# EAGLE design ap_eap_pcb (EAGLE 9.6.2)
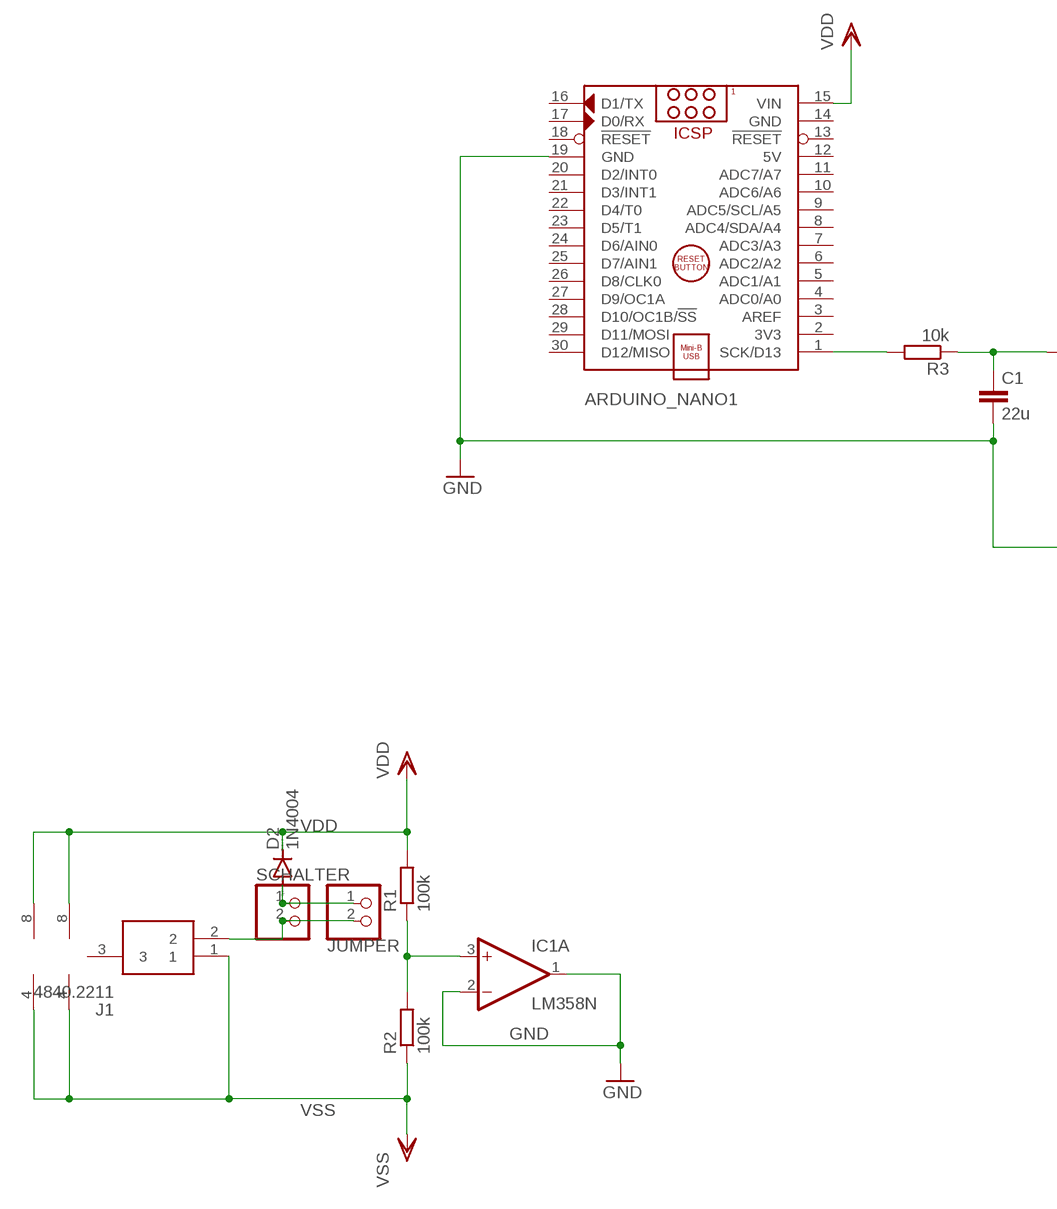
[diagram p0: schematic, sheet 1, part 1 of 2]
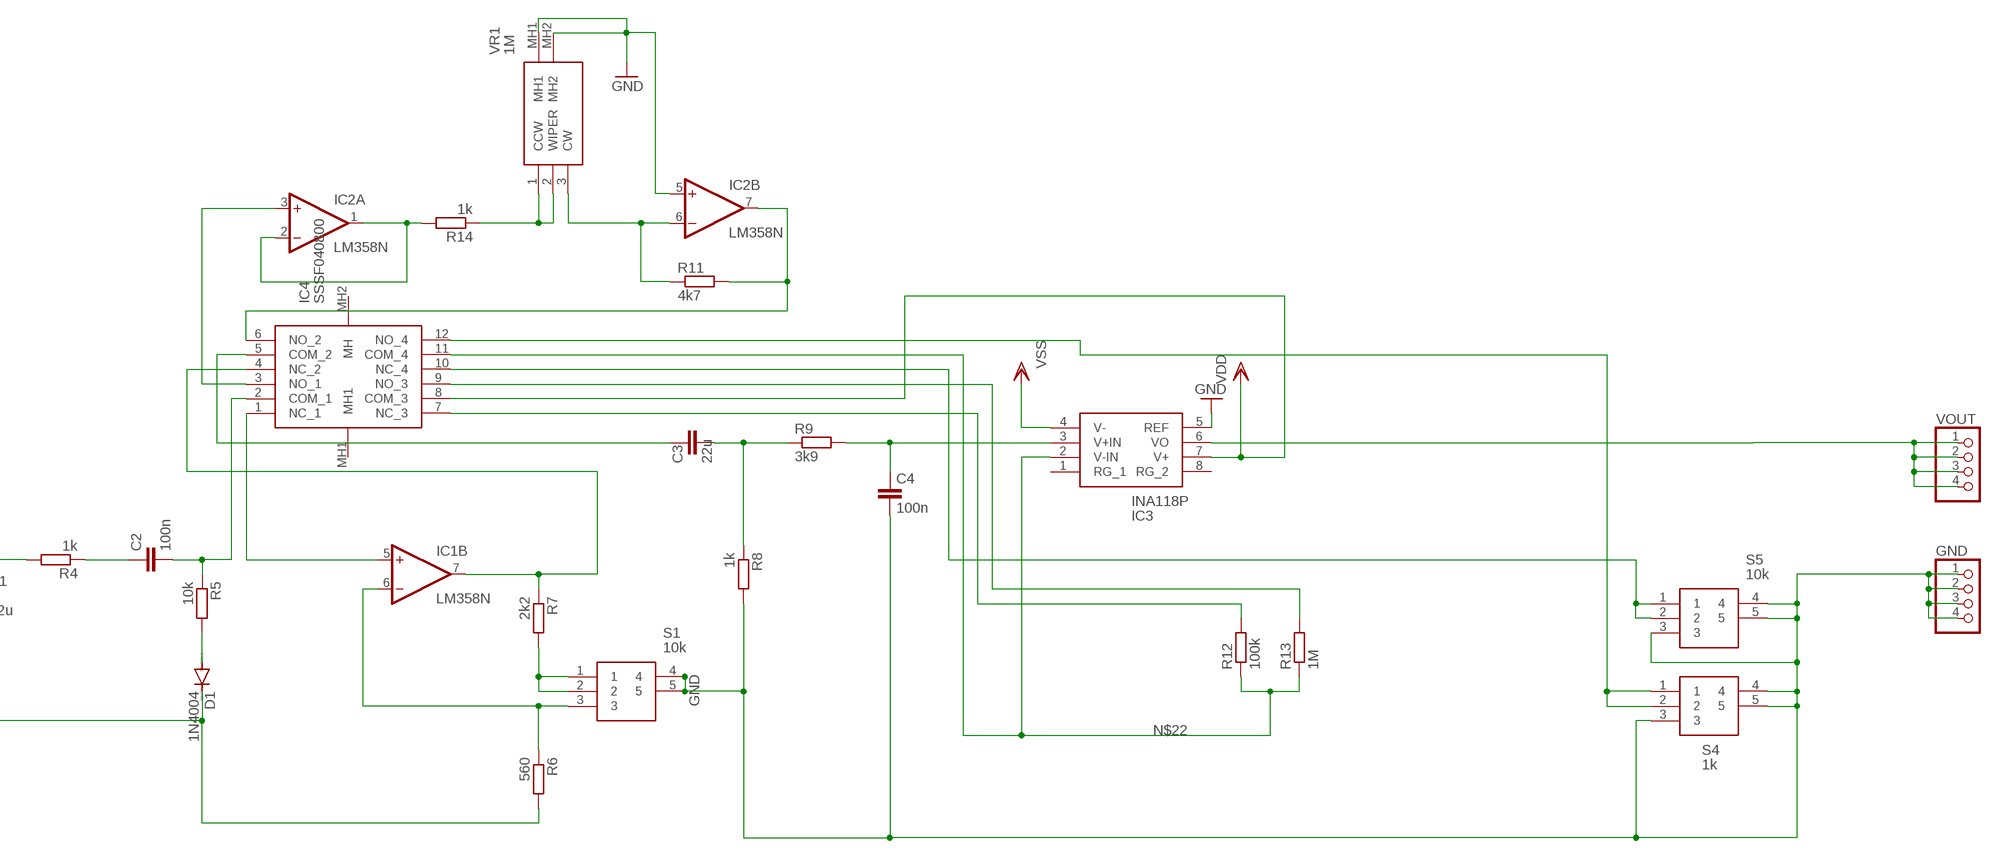
[diagram p1: schematic, sheet 1, part 2 of 2]

## Parts
ARDUINO_NANO1  ARDUINO_NANO  [ARDUINO_NANO]
C1  22u  C-EU025-024X044  [C025-024X044]
C2  100n  C-EU050-024X044  [C050-024X044]
C3  22u  C-EU025-050X050  [C025-050X050]
C4  100n  C-EU025-024X044  [C025-024X044]
D1  1N4004  [DO41-10]
D2  1N4004  [DO41-10]
GND  PINHD-1X4  [1X04]
IC1  LM358N  [DIL08]
IC2  LM358N  [DIL08]
IC3  INA118P  [DIP794W53P254L959H508Q8N]
IC4  SSSF040800  [SSSF040800]
J1  4840.2211  [48402211]
JUMPER  PINHD-1X2  [1X02]
R1  100k  R-EU_0309/12  [0309/12]
R2  100k  R-EU_0309/12  [0309/12]
R3  10k  R-EU_0309/12  [0309/12]
R4  1k  R-EU_0309/12  [0309/12]
R5  10k  R-EU_0309/12  [0309/12]
R6  560  R-EU_0309/12  [0309/12]
R7  2k2  R-EU_0309/12  [0309/12]
R8  1k  R-EU_0309/12  [0309/12]
R9  3k9  R-EU_0309/12  [0309/12]
R11  4k7  R-EU_0309/12  [0309/12]
R12  100k  R-EU_0309/12  [0309/12]
R13  1M  R-EU_0309/12  [0309/12]
R14  1k  R-EU_0309/12  [0309/12]
S1  10k  PTV09A-4225F-B102  [PTV09A4020FB103]
S4  1k  PTV09A-4225F-B102  [PTV09A4020FB103]
S5  10k  PTV09A-4225F-B102  [PTV09A4020FB103]
SCHALTER  PINHD-1X2  [1X02]
VOUT  PINHD-1X4  [1X04]
VR1  1M  RV09AF-40-20K-A1M  [RV09AF4020KA1M]

## Nets
GND: ARDUINO_NANO1.19(GND) C1.2 C4.2 D1.C GND.1 GND.2 GND.3 GND.4 IC1.1(A:OUT) IC1.2(A:-IN) IC2.5(B:+IN) IC3.5(REF) R6.2 R8.2 S1.4 S1.5 S4.3 S4.4 S4.5 S5.3 S5.4 S5.5 VR1.MH1 VR1.MH2
N$1: C1.1 R3.1 R4.2
N$2: IC1.3(A:+IN) R1.1 R2.2
N$3: ARDUINO_NANO1.1(SCK/D13) R3.2
N$4: C2.1 R4.1
N$5: C2.2 IC4.2(COM_1) R5.1
N$6: D1.A R5.2
N$7: C3.2 R8.1 R9.1
N$8: IC1.7(B:OUT) IC4.4(NC_2) R7.1
N$9: R7.2 S1.1 S1.2
N$10: IC1.6(B:-IN) R6.1 S1.3
N$11: IC1.5(B:+IN) IC4.1(NC_1)
N$12: C3.1 IC4.5(COM_2)
N$13: IC3.6(VO)
N$14: C4.1 IC3.3(V+IN) R9.2
N$15: VOUT.1 VOUT.2 VOUT.3 VOUT.4
N$16: IC2.3(A:+IN) IC4.3(NO_1)
N$17: IC2.1(A:OUT) IC2.2(A:-IN) R14.2
N$18: IC4.7(NC_3) R12.2
N$19: IC2.7(B:OUT) IC4.6(NO_2) R11.2
N$20: IC2.6(B:-IN) R11.1 VR1.3(CW)
N$21: IC4.9(NO_3) R13.2
N$22: IC3.2(V-IN) IC4.11(COM_4) R12.1 R13.1
N$23: IC4.12(NO_4) S4.1 S4.2
N$24: IC4.10(NC_4) S5.1 S5.2
N$25: J1.2 JUMPER.2 SCHALTER.2
N$26: D2.A JUMPER.1 SCHALTER.1
N$27: R14.1 VR1.1(CCW) VR1.2(WIPER)
VDD: ARDUINO_NANO1.15(VIN) D2.C IC1.8(P:V+) IC2.8(P:V+) IC3.7(V+) IC4.8(COM_3) R1.2
VSS: IC1.4(P:V-) IC2.4(P:V-) IC3.4(V-) J1.1 R2.1
Unconnected: ARDUINO_NANO1.2(3V3) ARDUINO_NANO1.3(AREF) ARDUINO_NANO1.4(ADC0/A0) ARDUINO_NANO1.5(ADC1/A1) ARDUINO_NANO1.6(ADC2/A2) ARDUINO_NANO1.7(ADC3/A3) ARDUINO_NANO1.8(ADC4/SDA/A4) ARDUINO_NANO1.9(ADC5/SCL/A5) ARDUINO_NANO1.10(ADC6/A6) ARDUINO_NANO1.11(ADC7/A7) ARDUINO_NANO1.13(!RESET) ARDUINO_NANO1.16(D1/TX) ARDUINO_NANO1.17(D0/RX) ARDUINO_NANO1.18(!RESET) ARDUINO_NANO1.20(D2/INT0) ARDUINO_NANO1.21(D3/INT1) ARDUINO_NANO1.22(D4/T0) ARDUINO_NANO1.23(D5/T1) ARDUINO_NANO1.24(D6/AIN0) ARDUINO_NANO1.25(D7/AIN1) ARDUINO_NANO1.26(D8/CLK0) ARDUINO_NANO1.27(D9/OC1A) ARDUINO_NANO1.28(D10/OC1B/!SS) ARDUINO_NANO1.29(D11/MOSI) ARDUINO_NANO1.30(D12/MISO) IC3.1(RG_1) IC3.8(RG_2) IC4.MH1 IC4.MH2(MH) J1.3

## Power pins joined to a net without a drawn wire
5V: ARDUINO_NANO1.12(5V)
GND: ARDUINO_NANO1.14(GND)

## Library data of the parts
ARDUINO_NANO1 = ArduinoNanoV30:ARDUINO_NANO: Arduino Nano V3.0 Module Overview: The Arduino Nano is a small, complete, and breadboard-friendly board based on the ATmega328 (Arduino Nano 3.x) or ATmega168 (Arduino Nano 2.x). It has more or less the same functionality of the Arduino Duemilanove, but in a different package. It lacks only a DC power jack, and works with a Mini-B USB cable instead of a standard one. The Nano was designed and is being produced by Gravitech <http://www.gravitech.us/arna30wiatp.html>. General specifications: Item Value Microcontroller Atmel ATmega168 or ATmega328 Operating Voltage (logic level) 5 V Input Voltage (recommended) 7-12 V Input Voltage (limits) 6-20 V Digital I/O Pins 14 (of which 6 provide PWM output) Analog Input Pins 8 DC Current per I/O Pin 40 mA Flash Memory 16 KB (ATmega168) or 32 KB (ATmega328) of which 2 KB used by bootloader SRAM 1 KB (ATmega168) or 2 KB (ATmega328) EEPROM 512 bytes (ATmega168) or 1 KB (ATmega328) Clock Speed 16 MHz Dimensions (Inches) 0.73" x 1.70" Dimensions (mm) 18mm x 45mm Overall height About 9 mm (not including pins) Weigth 5 g Power: The Arduino Nano can be powered via the Mini-B USB connection, 6-20V unregulated external power supply (pin 30), or 5V regulated external power supply (pin 27). The power source is automatically selected to the highest voltage source. Memory: The ATmega168 has 16 KB of flash memory for storing code (of which 2 KB is used for the bootloader); the ATmega328 has 32 KB, (also with 2 KB used for the bootloader). The ATmega168 has 1 KB of SRAM and 512 bytes of EEPROM (which can be read and written with the EEPROM library); the ATmega328 has 2 KB of SRAM and 1 KB of EEPROM. Input and Output: Each of the 14 digital pins on the Nano can be used as an input or output, using pinMode(), digitalWrite(), and digitalRead() functions. They operate at 5 volts. Each pin can provide or receive a maximum of 40 mA and has an internal pull-up resistor (disconnected by default) of 20-50 kOhms. In addition, some pins have specialized functions. Visit Arduino - ArduinoBoardNano <https://www.arduino.cc/en/Main/ArduinoBoardNano>
C1-C4 = rcl:C-EU: CAPACITOR, European symbol; SPICEPREFIX: C
D1 D2 = diode:1N4004: DIODE general purpose rectifier, 1 A
GND VOUT = pinhead:PINHD-1X4: PIN HEADER
IC1 IC2 = linear:LM358: OP AMP also LM158; LM258; LM2904 Source: http://cache.national.com/ds/LM/LM158.pdf
IC3 = INA118P:INA118P: INA118P, Instrumentation Amplifier, 73dB CMRR, 8-Pin PDIP Source: Datasheet <http://www.ti.com/lit/ds/symlink/ina118.pdf>; DESCRIPTION: INA118P, Instrumentation Amplifier, 73dB CMRR, 8-Pin PDIP; HEIGHT: 5.08mm; MANUFACTURER_NAME: Texas Instruments; MANUFACTURER_PART_NUMBER: INA118P; MOUSER_PART_NUMBER: 595-INA118P; MOUSER_PRICE-STOCK: https://www.mouser.co.uk/ProductDetail/Texas-Instruments/INA118P/?qs=VBduBm9rCJTJMgcSbr%252BM%252BQ%3D%3D
IC4 = SSSF040800:SSSF040800: Through Hole Slide Switch 4PDT Maintained 100 mA Slide Source: Datasheet <http://uk.rs-online.com/web/p/products/1238902>; DESCRIPTION: Through Hole Slide Switch 4PDT Maintained 100 mA Slide; HEIGHT: 14.5mm; MANUFACTURER_NAME: ALPS; MANUFACTURER_PART_NUMBER: SSSF040800; RS_PART_NUMBER: 1238902; RS_PRICE-STOCK: http://uk.rs-online.com/web/p/products/1238902
J1 = 4840.2211:4840.2211: DC Power Connectors DC SOCKET 2.35MM PCB MOUNT Source: Datasheet <http://www.schurterinc.com/bundles/snceschurter/epim/_ProdPool_/newDS/en/typ_4840.2211.pdf>; DESCRIPTION: DC Power Connectors DC SOCKET 2.35MM PCB MOUNT; HEIGHT: 11mm; MANUFACTURER_NAME: SCHURTER; MANUFACTURER_PART_NUMBER: 4840.2211; MOUSER_PART_NUMBER: 693-4840.2211; MOUSER_PRICE-STOCK: https://www.mouser.co.uk/ProductDetail/Schurter/48402211?qs=wwP%252BWDYHj0YnjLRL9j928g%3D%3D
JUMPER SCHALTER = pinhead:PINHD-1X2: PIN HEADER
R1-R9 R11-R14 = rcl:R-EU_: RESISTOR, European symbol; SPICEPREFIX: R
S1 S4 S5 = PTV09A-4225F-B102:PTV09A-4225F-B102: 9mm carbon potentiometer linear 1K 20% Source: Datasheet <https://www.bourns.com/pdfs/PTV09.pdf>; DESCRIPTION: 9mm carbon potentiometer linear 1K 20%; HEIGHT: 20mm; MANUFACTURER_NAME: Bourns; MANUFACTURER_PART_NUMBER: PTV09A-4225F-B102; MOUSER_PART_NUMBER: 652-PTV09A-4225FB102; MOUSER_PRICE-STOCK: https://www.mouser.co.uk/ProductDetail/Bourns/PTV09A-4225F-B102?qs=Qzws7J6gxqyeFhc0kO3Q7A%3D%3D
VR1 = RV09AF-40-20K-A1M:RV09AF-40-20K-A1M: Potentiometers Audio 9mm 1M Source: Datasheet <https://www.mouser.co.uk/datasheet/2/13/V09AF-1522357.pdf>; DESCRIPTION: Potentiometers Audio 9mm 1M; HEIGHT: 20.5mm; MANUFACTURER_NAME: Alpha (Taiwan); MANUFACTURER_PART_NUMBER: RV09AF-40-20K-A1M; MOUSER_PART_NUMBER: 317-2080F-1M; MOUSER_PRICE-STOCK: https://www.mouser.co.uk/ProductDetail/Alpha-Taiwan/RV09AF-40-20K-A1M?qs=j%252B1pi9TdxUYsYyUO2HEVPg%3D%3D

## Board
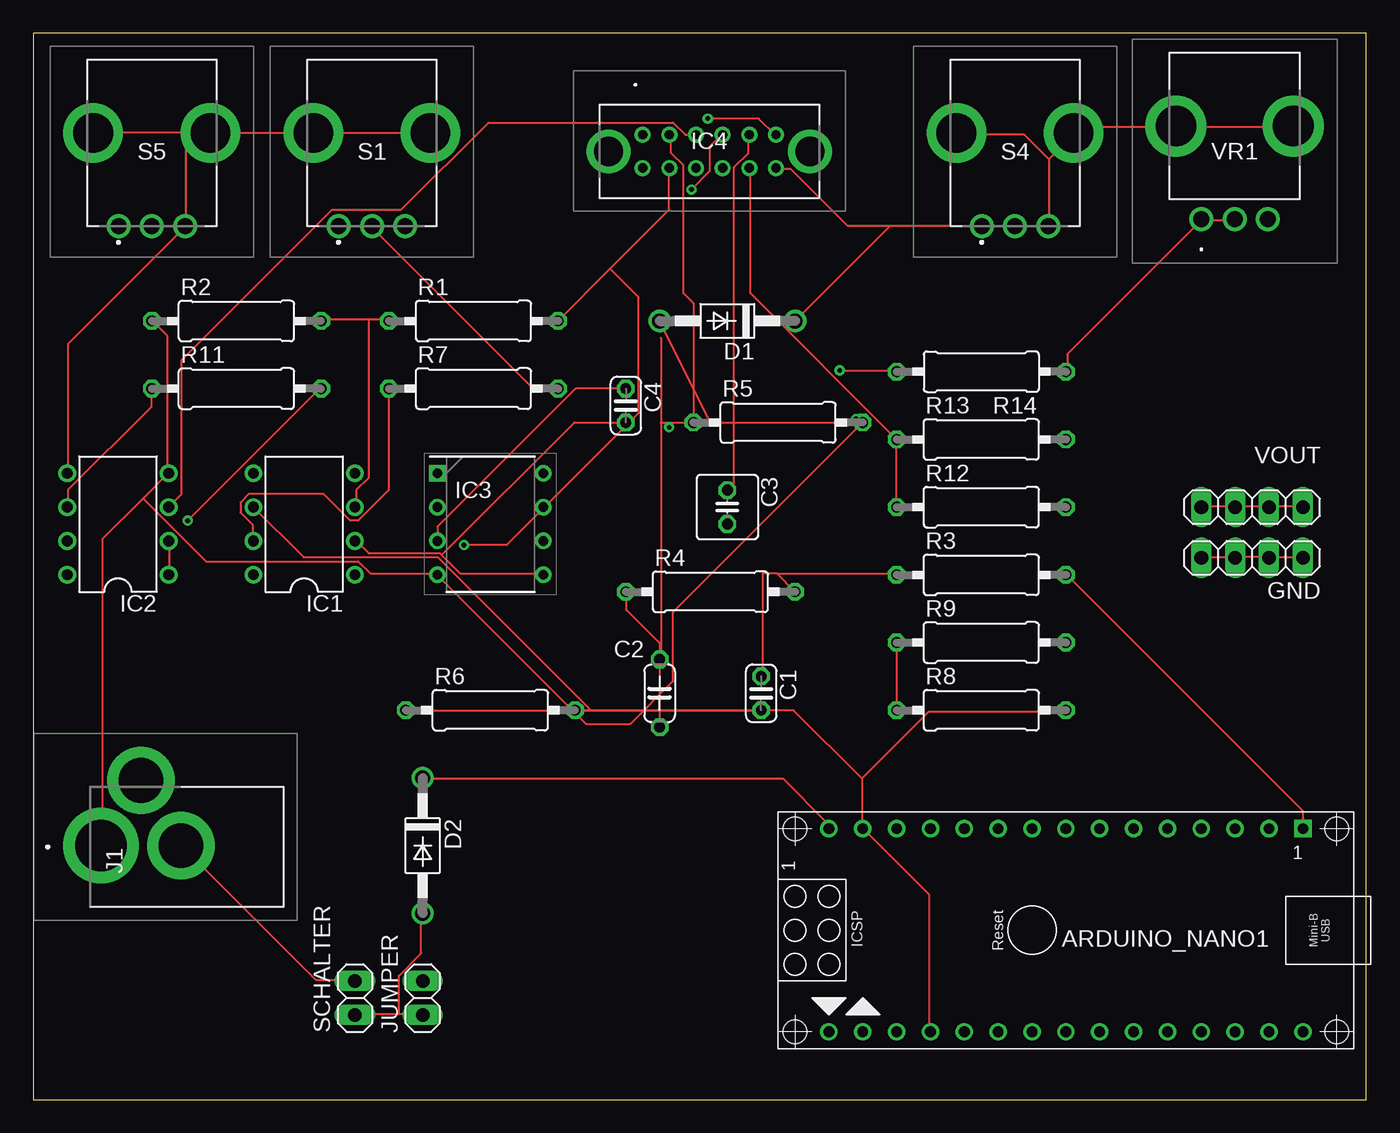
[diagram p2: board, top side]
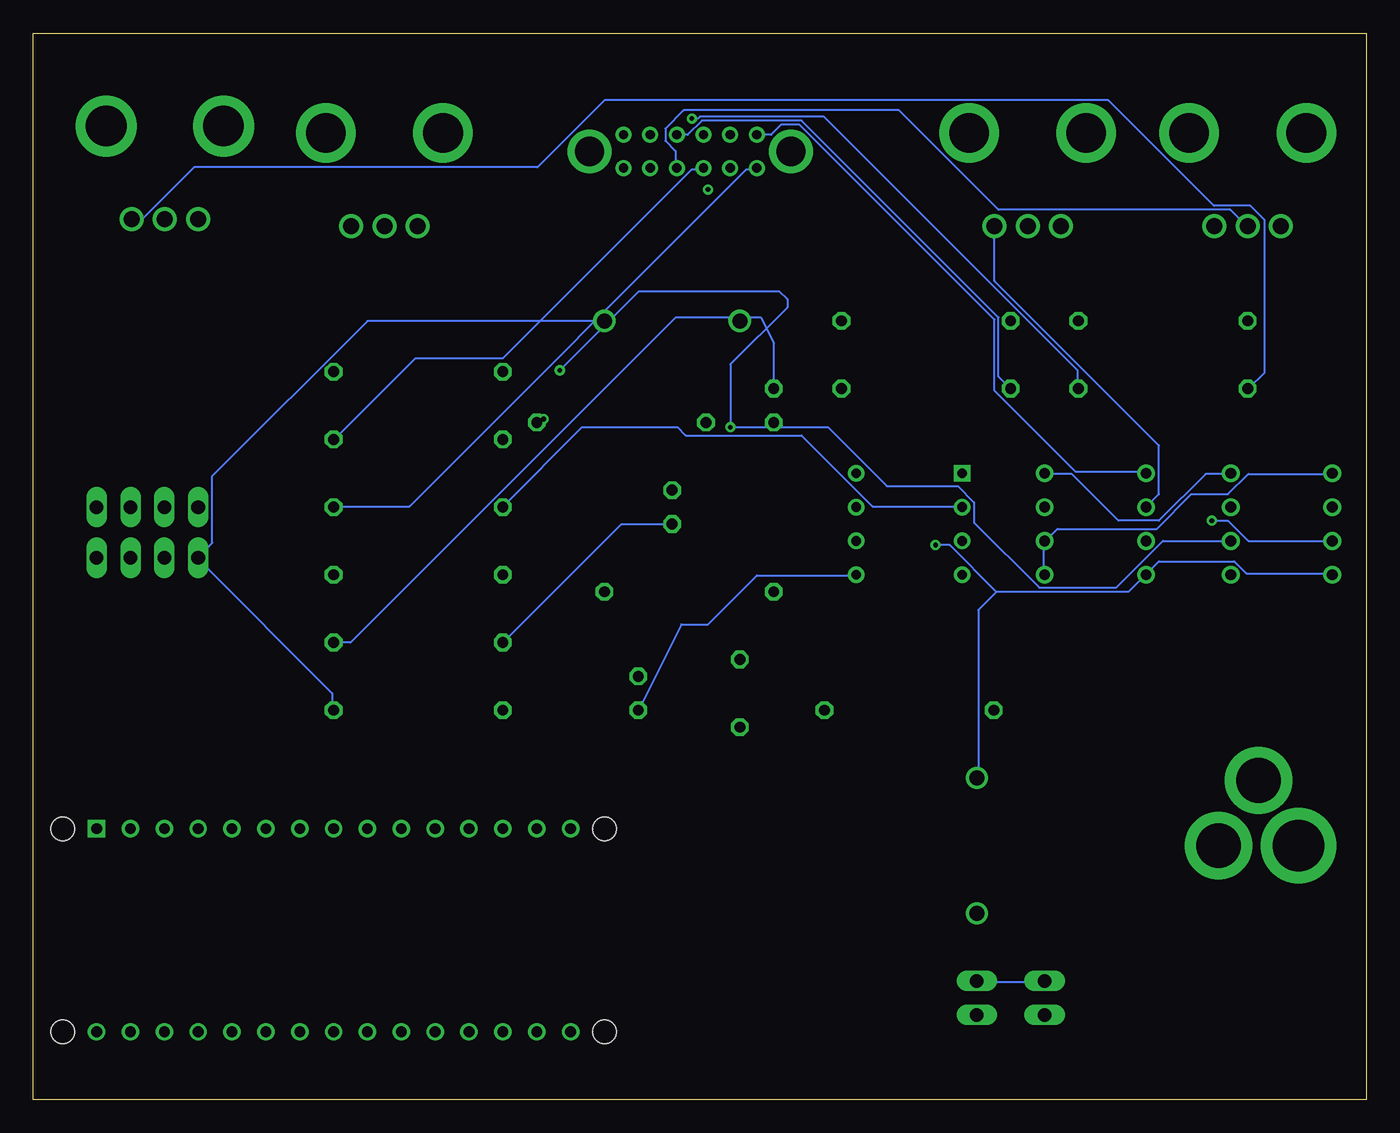
[diagram p3: board, bottom side, seen from below]

Size 100 x 80 mm. Coordinates in mm from the lower left corner, seen from the top.
Outline: 0,0 100,0 100,80 0,80 0,0
Copper layers (1*16): Top 0.035mm / dielectric 1.5mm / Bottom 0.035mm
Design rules "default": minimum track width 6mil, minimum drill 0.35mm, track to track 6mil, track to pad 6mil, pad to pad 6mil, via to via 6mil, smd to smd 6mil, copper to edge 40mil, drill to drill 6mil, minimum pad ring 10mil, minimum via ring 8mil, stop-mask expansion 4mil, vias tented up to drill 0mil, thermal gap 10mil

### Footprints (pad centres in the part's own frame; a part is rotated, then mirrored left to right if it is on the bottom)
ARDUINO_NANO = drill 0.8 square: 1 -20.32,-7.62 | drill 0.8: 2 -17.78,-7.62; 3 -15.24,-7.62; 4 -12.7,-7.62; 5 -10.16,-7.62; 6 -7.62,-7.62; 7 -5.08,-7.62; 8 -2.54,-7.62; 9 0,-7.62; 10 2.54,-7.62; 11 5.08,-7.62; 12 7.62,-7.62; 13 10.16,-7.62; 14 12.7,-7.62; 15 15.24,-7.62; 16 15.24,7.62; 17 12.7,7.62; 18 10.16,7.62; 19 7.62,7.62; 20 5.08,7.62; 21 2.54,7.62; 22 0,7.62; 23 -2.54,7.62; 24 -5.08,7.62; 25 -7.62,7.62; 26 -10.16,7.62; 27 -12.7,7.62; 28 -15.24,7.62; 29 -17.78,7.62; 30 -20.32,7.62 | hole 1.778: -22.86,-7.62; -22.86,7.62; 17.78,7.62; 17.78,-7.62
C025-024X044 = drill 0.813 octagon: 1 -1.27,0; 2 1.27,0
C050-024X044 = drill 0.813 octagon: 1 -2.54,0; 2 2.54,0
C025-050X050 = drill 0.813 octagon: 1 -1.27,0; 2 1.27,0
DO41-10 = drill 1.118: A 5.08,0; C -5.08,0
1X04 = drill 1.016 long: 1 -3.81,0; 2 -1.27,0; 3 1.27,0; 4 3.81,0
DIL08 = drill 0.813 pad 1.27: 1 -3.81,-3.81; 2 -1.27,-3.81; 3 1.27,-3.81; 4 3.81,-3.81; 5 3.81,3.81; 6 1.27,3.81; 7 -1.27,3.81; 8 -3.81,3.81
DIP794W53P254L959H508Q8N = drill 0.73 pad 1.13 square: 1 -3.97,3.81 | drill 0.73 pad 1.13: 2 -3.97,1.27; 3 -3.97,-1.27; 4 -3.97,-3.81; 5 3.97,-3.81; 6 3.97,-1.27; 7 3.97,1.27; 8 3.97,3.81
SSSF040800 = drill 0.7 pad 1.2: 1 0,0; 2 2,0; 3 4,0; 4 6,0; 5 8,0; 6 10,0; 7 0,-2.5; 8 2,-2.5; 9 4,-2.5; 10 6,-2.5; 11 8,-2.5; 12 10,-2.5 | drill 2.19 pad 3.285: MH1 -2.555,-1.25; MH2 12.555,-1.25
48402211 = drill 3.84 pad 5.66: 1 0,0 | drill 3.36 pad 5.04: 2 0,-6; 3 4.9,-3
1X02 = drill 1.016 long: 1 -1.27,0; 2 1.27,0
0309/12 = drill 0.813 octagon: 1 -6.35,0; 2 6.35,0
PTV09A4020FB103 = drill 1.2 pad 1.8: 1 -2.5,-5.6; 2 0,-5.6; 3 2.5,-5.6 | drill 2.973 pad 4.46: 4 -4.4,1.4; 5 4.4,1.4
RV09AF4020KA1M = drill 1.2 pad 1.8: 1 0,0; 2 2.5,0; 3 5,0 | drill 3.048 pad 4.572: MH1 -1.9,7; MH2 6.9,7

### Placement (x,y rotation side)
ARDUINO_NANO1  74.93,12.7 180 top
C1  54.61,30.48 270 top
C2  46.99,30.48 90 top
C3  52.07,44.45 270 top
C4  44.45,52.07 270 top
D1  52.07,58.42 180 top
D2  29.21,19.05 270 top
GND  91.44,40.64 180 top
IC1  20.32,43.18 90 top
IC2  6.35,43.18 90 top
IC3  34.29,43.18 0 top
IC4  45.72,72.39 0 top
J1  5.08,19.05 90 top
JUMPER  29.21,7.62 90 top
R1  33.02,58.42 0 top
R2  15.24,58.42 0 top
R3  71.12,39.37 0 top
R4  50.8,38.1 0 top
R5  55.88,50.8 0 top
R6  34.29,29.21 0 top
R7  33.02,53.34 0 top
R8  71.12,29.21 0 top
R9  71.12,34.29 0 top
R11  15.24,53.34 0 top
R12  71.12,44.45 0 top
R13  71.12,49.53 0 top
R14  71.12,54.61 180 top
S1  25.4,71.12 0 top
S4  73.66,71.12 0 top
S5  8.89,71.12 0 top
SCHALTER  24.13,7.62 90 top
VOUT  91.44,44.45 180 top
VR1  87.63,66.04 0 top

### Tracks (layer width: path | path; a pad name or v marks a point on that pad's centre or on a via)
GND
  Top 0.152: IC2.5 2.59,47.09 2.59,56.69 11.28,65.38 S5.3 11.43,65.53 11.43,72.54 | 11.43,72.54 13.26,72.54 S5.5 | 11.43,72.54 4.57,72.54 S5.4 | S5.5 13.41,72.54 20.88,72.54 S1.4 21.03,72.54 29.72,72.54 S1.5 | 11.43,72.54 S5.5 | D1.C 64.25,65.52 S4.3 76.2,65.53 76.2,70.56 | 76.2,70.56 78.03,72.39 S4.5 78.18,72.54 78.64,73 85.65,73 VR1.MH1 85.8,73 94.49,73 VR1.MH2 | 76.2,70.56 74.37,72.39 69.34,72.39 S4.4 | 30.63,40.84 30.48,41 25.15,41 24.23,41.91 IC1.2 | 30.63,40.84 32,39.47 38.25,39.47 IC3.5 | 30.63,40.84 40.59,50.8 C4.2 | GND.1 95.25,40.69 92.81,40.69 GND.2 92.66,40.69 90.22,40.69 GND.3 90.07,40.69 87.63,40.69 GND.4 | 62.18,24.08 62.18,20.42 ARDUINO_NANO1.14 62.33,20.27 67.21,15.39 67.21,5.18 ARDUINO_NANO1.19 | 62.18,24.08 57.05,29.21 R6.2 C1.2 | 62.18,24.08 67.21,29.11 77.42,29.11 R8.2
  Bottom 0.152: IC1.1 24.23,39.47 24.23,41.91 IC1.2 24.08,41.91 23.16,42.82 15.7,42.82 13.11,45.41 10.36,45.41 8.84,46.94 2.59,46.94 IC2.5 | R8.2 77.57,29.26 77.57,30.48 87.63,40.54 GND.4 87.63,40.69 86.56,41.76 86.56,46.79 74.93,58.42 D1.C | IC3.5 38.41,39.32 45.72,39.32 49.38,35.66 51.38,35.66 C1.2
N$1
  Top 0.152: C1.1 54.71,31.75 54.71,39.47 55.78,39.47 | R4.2 55.78,39.47 | 55.78,39.47 64.77,39.47 R3.1
N$2
  Top 0.152: 25.15,58.52 26.67,58.52 R1.1 | 25.15,58.52 21.64,58.52 R2.2 | 25.15,58.52 25.15,46.63 24.23,45.72 24.23,44.5 IC1.3
N$3
  Top 0.152: ARDUINO_NANO1.1 95.25,21.64 77.57,39.32 R3.2
N$4
  Top 0.152: R4.1 44.5,38 44.5,36.73 46.99,34.24 C2.1
N$5
  Top 0.152: IC4.2 47.85,72.39 47.85,71.02 48.77,70.1 48.77,60.5 49.53,59.74 R5.1 47.09,50.8 | 47.09,57.15 47.09,50.8 | C2.2 47.09,33.12 47.09,50.75 47.09,50.8
N$6
  Top 0.152: R5.2 50.8,50.8 D1.A
N$7
  Top 0.152: R9.1 R8.1
  Bottom 0.152: R9.1 55.88,43.18 C3.2
N$8  (via drill 0.35)
  Top 0.152: v49.38,68.28 50.75,69.65 50.75,71.48 51.66,72.39 IC4.4 | R7.1 26.67,45.72 24.38,43.43 23.77,43.43 21.79,45.41 16.15,45.41 15.54,44.81 15.54,44.04 16.46,43.13 16.46,41.91 IC1.7
  Bottom 0.152: IC4.4 50.9,72.39 49.84,73.46 42.37,73.46 27.58,58.67 27.58,54.25 R7.1
N$9
  Top 0.152: R7.2 37.49,53.34 25.45,65.38 S1.2 25.3,65.53 23.01,65.53 S1.1
N$10
  Top 0.152: IC1.6 20.27,40.69 30.33,40.69 41.76,29.26 41.73,29.21 R6.1
  Bottom 0.152: IC1.6 15.54,45.41 15.54,49.07 27.89,61.42 27.89,65.38 S1.3
N$11
  Bottom 0.152: IC4.1 44.65,72.39 43.89,73.15 42.52,73.15 27.89,58.52 27.89,53.19 21.79,47.09 16.61,47.09 IC1.5
N$12
  Top 0.152: C3.1 52.58,46.23 52.58,69.95 53.65,71.02 53.65,72.39 IC4.5
N$14
  Top 0.152: C4.1 40.69,53.34 30.33,42.98 IC3.3
  Bottom 0.152: R9.2 76.2,34.29 51.82,58.67 45.41,58.67 44.45,56.74 C4.1
N$15
  Top 0.152: VOUT.4 87.63,44.5 90.07,44.5 VOUT.3 90.22,44.5 92.66,44.5 VOUT.2 92.81,44.5 95.25,44.5 VOUT.1
N$16
  Top 0.152: IC4.3 48.92,72.39 48.01,73.3 34.14,73.3 27.58,66.75 22.4,66.75 11.12,55.47 11.12,45.41 IC2.3
N$17  (via drill 0.35)
  Top 0.152: IC2.1 10.21,39.47 10.21,41.91 IC2.2 | v60.5,54.71 64.77,54.71 R14.2
  Bottom 0.152: v60.5,54.71 54.56,60.66 44.04,60.66 43.43,60.05 43.43,59.44 47.7,55.17 v47.7,50.44 40.39,50.44 35.97,46.02 30.63,46.02 29.41,44.81 29.41,43.28 24.54,38.41 18.75,38.41 15.24,41.91 IC2.2
N$18
  Bottom 0.152: IC4.7 45.72,69.8 46.48,69.8 71.78,44.5 77.42,44.5 R12.2
N$19  (via drill 0.35)
  Top 0.152: v50.6,73.61 54.41,73.61 55.63,72.39 IC4.6 | v11.58,43.43 21.49,53.34 R11.2
  Bottom 0.152: IC2.7 8.84,41.91 10.36,43.43 v11.58,43.43 | v50.6,73.61 50.14,73.61 49.99,73.76 40.69,73.76 21.64,54.71 21.64,53.34 R11.2
N$20
  Top 0.152: IC2.6 2.59,44.5 2.59,45.72 8.84,51.97 8.84,53.34 R11.1
  Bottom 0.152: VR1.3 92.51,66.14 91.75,66.14 87.94,69.95 62.18,69.95 57.15,74.98 19.36,74.98 11.43,67.06 8.69,67.06 7.62,65.99 7.62,54.56 8.84,53.34 R11.1
N$21
  Bottom 0.152: IC4.9 49.84,69.8 50.6,69.8 64.77,55.63 71.32,55.63 77.42,49.53 R13.2
N$22
  Top 0.152: IC4.11 53.8,69.8 53.8,60.5 R13.1 R12.1
  Bottom 0.152: IC3.2 30.33,44.5 37.03,44.5 42.37,49.84 51.05,49.84 51.66,50.44 58.83,50.44 64.77,44.5 R12.1
N$23
  Top 0.152: IC4.12 55.78,69.8 56.84,69.8 61.11,65.53 71.02,65.53 S4.1 71.17,65.53 73.61,65.53 S4.2
N$24
  Top 0.152: S5.1 6.4,65.53 8.84,65.53 S5.2
  Bottom 0.152: IC4.10 51.82,69.95 51.82,71.17 52.58,71.93 52.58,72.85 51.21,74.22 35.05,74.22 27.58,66.75 10.21,66.75 8.99,65.53 S5.2
N$25
  Top 0.152: SCHALTER.2 24.08,8.99 21.18,8.99 11.12,19.05 J1.2
  Bottom 0.152: SCHALTER.2 24.23,8.84 29.11,8.84 JUMPER.2
N$26
  Top 0.152: 27.43,6.4 29.11,6.4 JUMPER.1 | 27.43,6.4 24.23,6.4 SCHALTER.1 | 27.43,6.4 27.43,9.3 29.11,10.97 29.11,13.87 D2.A
N$27
  Top 0.152: 87.63,65.99 77.57,55.93 77.57,54.71 R14.1 | 87.63,65.99 90.07,65.99 VR1.2 | 87.63,65.99 VR1.1
VDD  (via drill 0.35)
  Top 0.152: ARDUINO_NANO1.15 59.59,20.42 59.59,20.73 56.24,24.08 29.26,24.08 D2.C | R1.2 43.28,62.33 | 43.28,62.33 47.7,66.75 47.7,69.8 IC4.8 | v32.31,41.6 35.51,41.6 38.25,44.35 IC3.7 38.41,44.5 45.41,51.51 45.41,60.2 43.28,62.33
  Bottom 0.152: IC2.8 2.59,39.47 8.99,39.47 9.91,40.39 15.54,40.39 16.46,39.47 IC1.8 16.61,39.32 17.83,38.1 27.74,38.1 | v32.31,41.6 31.24,41.6 27.74,38.1 | 27.74,38.1 29.11,36.73 29.11,24.23 D2.C
VSS  (via drill 0.35)
  Top 0.152: v61.72,51.05 61.72,50.29 48.01,36.58 48.01,31.39 44.81,28.19 41.45,28.19 30.33,39.32 IC3.4 30.18,39.47 25.3,39.47 24.38,40.39 12.95,40.39 8.23,45.11 | R2.1 8.99,58.37 10.06,57.3 10.06,47.09 IC2.4 10.06,46.94 8.23,45.11 | 8.23,45.11 5.18,42.06 5.18,19.05 J1.1
  Bottom 0.152: IC1.4 24.08,46.94 22.1,46.94 18.59,43.43 15.54,43.43 12.04,46.94 10.21,46.94 IC2.4